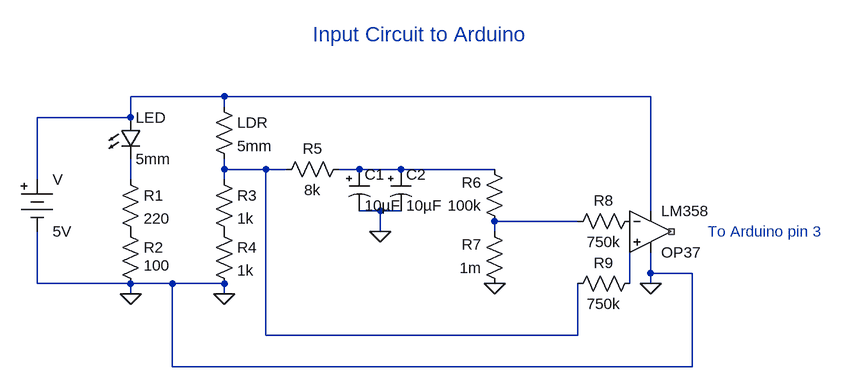
[diagram p0: schematic circuit diagram ltspice.asc]
circuit diagram ltspice.asc, the LTspice schematic file:
Version 4
SHEET 1 1220 680
WIRE 192 32 48 32
WIRE 848 32 192 32
WIRE 192 48 192 32
WIRE 48 64 48 32
WIRE 48 64 -96 64
WIRE 192 144 192 128
WIRE 256 144 192 144
WIRE 288 144 256 144
WIRE 400 144 368 144
WIRE 464 144 400 144
WIRE 608 144 464 144
WIRE -96 160 -96 64
WIRE 48 160 48 128
WIRE 192 160 192 144
WIRE 432 208 400 208
WIRE 464 208 432 208
WIRE 848 208 848 32
WIRE 736 224 608 224
WIRE 432 240 432 208
WIRE 608 240 608 224
WIRE 848 304 848 272
WIRE 912 304 848 304
WIRE -96 320 -96 240
WIRE 48 320 -96 320
WIRE 112 320 48 320
WIRE 192 320 112 320
WIRE 816 320 816 256
WIRE 848 320 848 304
WIRE 48 336 48 320
WIRE 192 336 192 320
WIRE 256 400 256 144
WIRE 736 400 736 320
WIRE 736 400 256 400
WIRE 112 448 112 320
WIRE 912 448 912 304
WIRE 912 448 112 448
FLAG 432 240 0
FLAG 608 320 0
FLAG 848 320 0
FLAG 192 336 0
FLAG 48 336 0
SYMBOL res 32 144 R0
SYMATTR InstName R1
SYMATTR Value 220
SYMBOL res 32 224 R0
WINDOW 3 36 68 Left 2
SYMATTR Value 100
SYMATTR InstName R2
SYMBOL res 176 144 R0
SYMATTR InstName R3
SYMATTR Value 1k
SYMBOL res 176 224 R0
SYMATTR InstName R4
SYMATTR Value 1k
SYMBOL LED 32 64 R0
SYMATTR InstName LED
SYMATTR Value 5mm
SYMBOL res 176 32 R0
SYMATTR InstName LDR
SYMATTR Value 5mm
SYMBOL res 384 128 R90
WINDOW 0 0 56 VBottom 2
WINDOW 3 32 56 VTop 2
SYMATTR InstName R5
SYMATTR Value 8k
SYMBOL res 624 240 R180
WINDOW 0 36 76 Left 2
WINDOW 3 36 40 Left 2
SYMATTR InstName R6
SYMATTR Value 100k
SYMBOL res 624 336 R180
WINDOW 0 36 76 Left 2
WINDOW 3 36 40 Left 2
SYMATTR InstName R7
SYMATTR Value 1m
SYMBOL res 720 240 R270
WINDOW 0 32 56 VTop 2
WINDOW 3 0 56 VBottom 2
SYMATTR InstName R8
SYMATTR Value 750k
SYMBOL res 720 336 R270
WINDOW 0 32 56 VTop 2
WINDOW 3 0 56 VBottom 2
SYMATTR InstName R9
SYMATTR Value 750k
SYMBOL Opamps\\OP37 848 176 R0
SYMATTR InstName LM358
SYMBOL polcap 384 144 R0
SYMATTR InstName C1
SYMATTR Value 10µF
SYMBOL polcap 448 144 R0
SYMATTR InstName C2
SYMATTR Value 10µF
SYMBOL Misc\\battery -96 144 R0
SYMATTR InstName V
SYMATTR Value 5V
TEXT 328 -64 Left 3 ;Input Circuit to Arduino
TEXT 936 240 Left 2 ;To Arduino pin 3

The netlist it stands for:
* circuit diagram ltspice.asc
R1 N004 P001 220
R2 P001 0 100
R3 N002 P002 1k
R4 P002 0 1k
D§LED N001 N004 5mm
R§LDR N001 N002 5mm
R5 N003 N002 8k
R6 N005 N003 100k
R7 0 N005 1m
R8 N005 P003 750k
R9 N002 N006 750k
XLM358 N006 P003 N001 0 NC_01 LT1037  ; OP37, pins In+ In- V+ V- OUT
C1 N003 0 10µF
C2 N003 0 10µF
V N001 0 5V
.model D D
.lib standard.dio
* Input Circuit to Arduino
* To Arduino pin 3
.lib LTC.lib
.backanno
.end